# Altium schematic sheet PhotoDiode.SchDoc: <title>
size A4; Organization: Institut d'Automatisation Industrielle; SheetNumber: 1; SheetTotal: 3; SVN: OUI; CurrentTime: 6; CurrentDate: 5; DocumentFullPathAndName: 8; DocumentName: 9; ModifiedDate: 13; ProjectName: <projet>
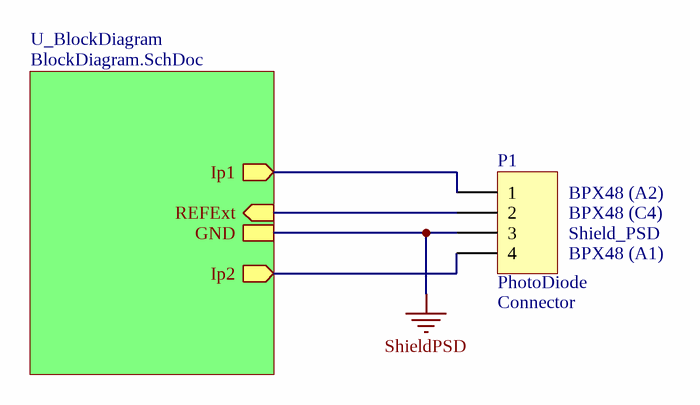
[diagram p0: PhotoDiode.SchDoc]

## Parts
P1  PhotoDiode  System: Connector  [HDR1X4H]

## Sub-sheets
U_BlockDiagram = BlockDiagram.SchDoc: Ip1 (out), Ip2 (out), GND, REFExt (in)

## Nets
ShieldPSD: P1.3 ; sheet U_BlockDiagram/GND
NetP1_1: P1.1 ; sheet U_BlockDiagram/Ip1
NetP1_2: P1.2 ; sheet U_BlockDiagram/REFExt
NetP1_4: P1.4 ; sheet U_BlockDiagram/Ip2

## Notes on the sheet
- (near P1) BPX48 (A2)
- (near P1) BPX48 (C4)
- (near P1) Shield_PSD
- (near P1) BPX48 (A1)
- Title
- Institut d'automatisation industrielle
  rte de Cheseaux 1
  CH-1401 Yverdon-les-Bains
  T +41(0)24 55 77 377    F +41(0)24 55 76 320
  http://iai.heig-vd.ch       iai@heig-vd.ch
- Date:
- Size:
- A4
- Project:
- Sheet
- of
- No.
- Author:
- SVN
- Version
- File:

## Library data of the parts
P1 = Header 4H: Header, 4-Pin, Right Angle; LatestRevisionDate: 17-Jul-2002; LatestRevisionNote: Re-released for DXP Platform.; Publisher: Altium Limited